# EasyEDA schematic LilyGo-LoRa32.json
TITLE: LilyGO LoRa Node with US Sensor; REV: 1.0; Date: 2024-10-19; Sheet: 1/1; Company: pkr
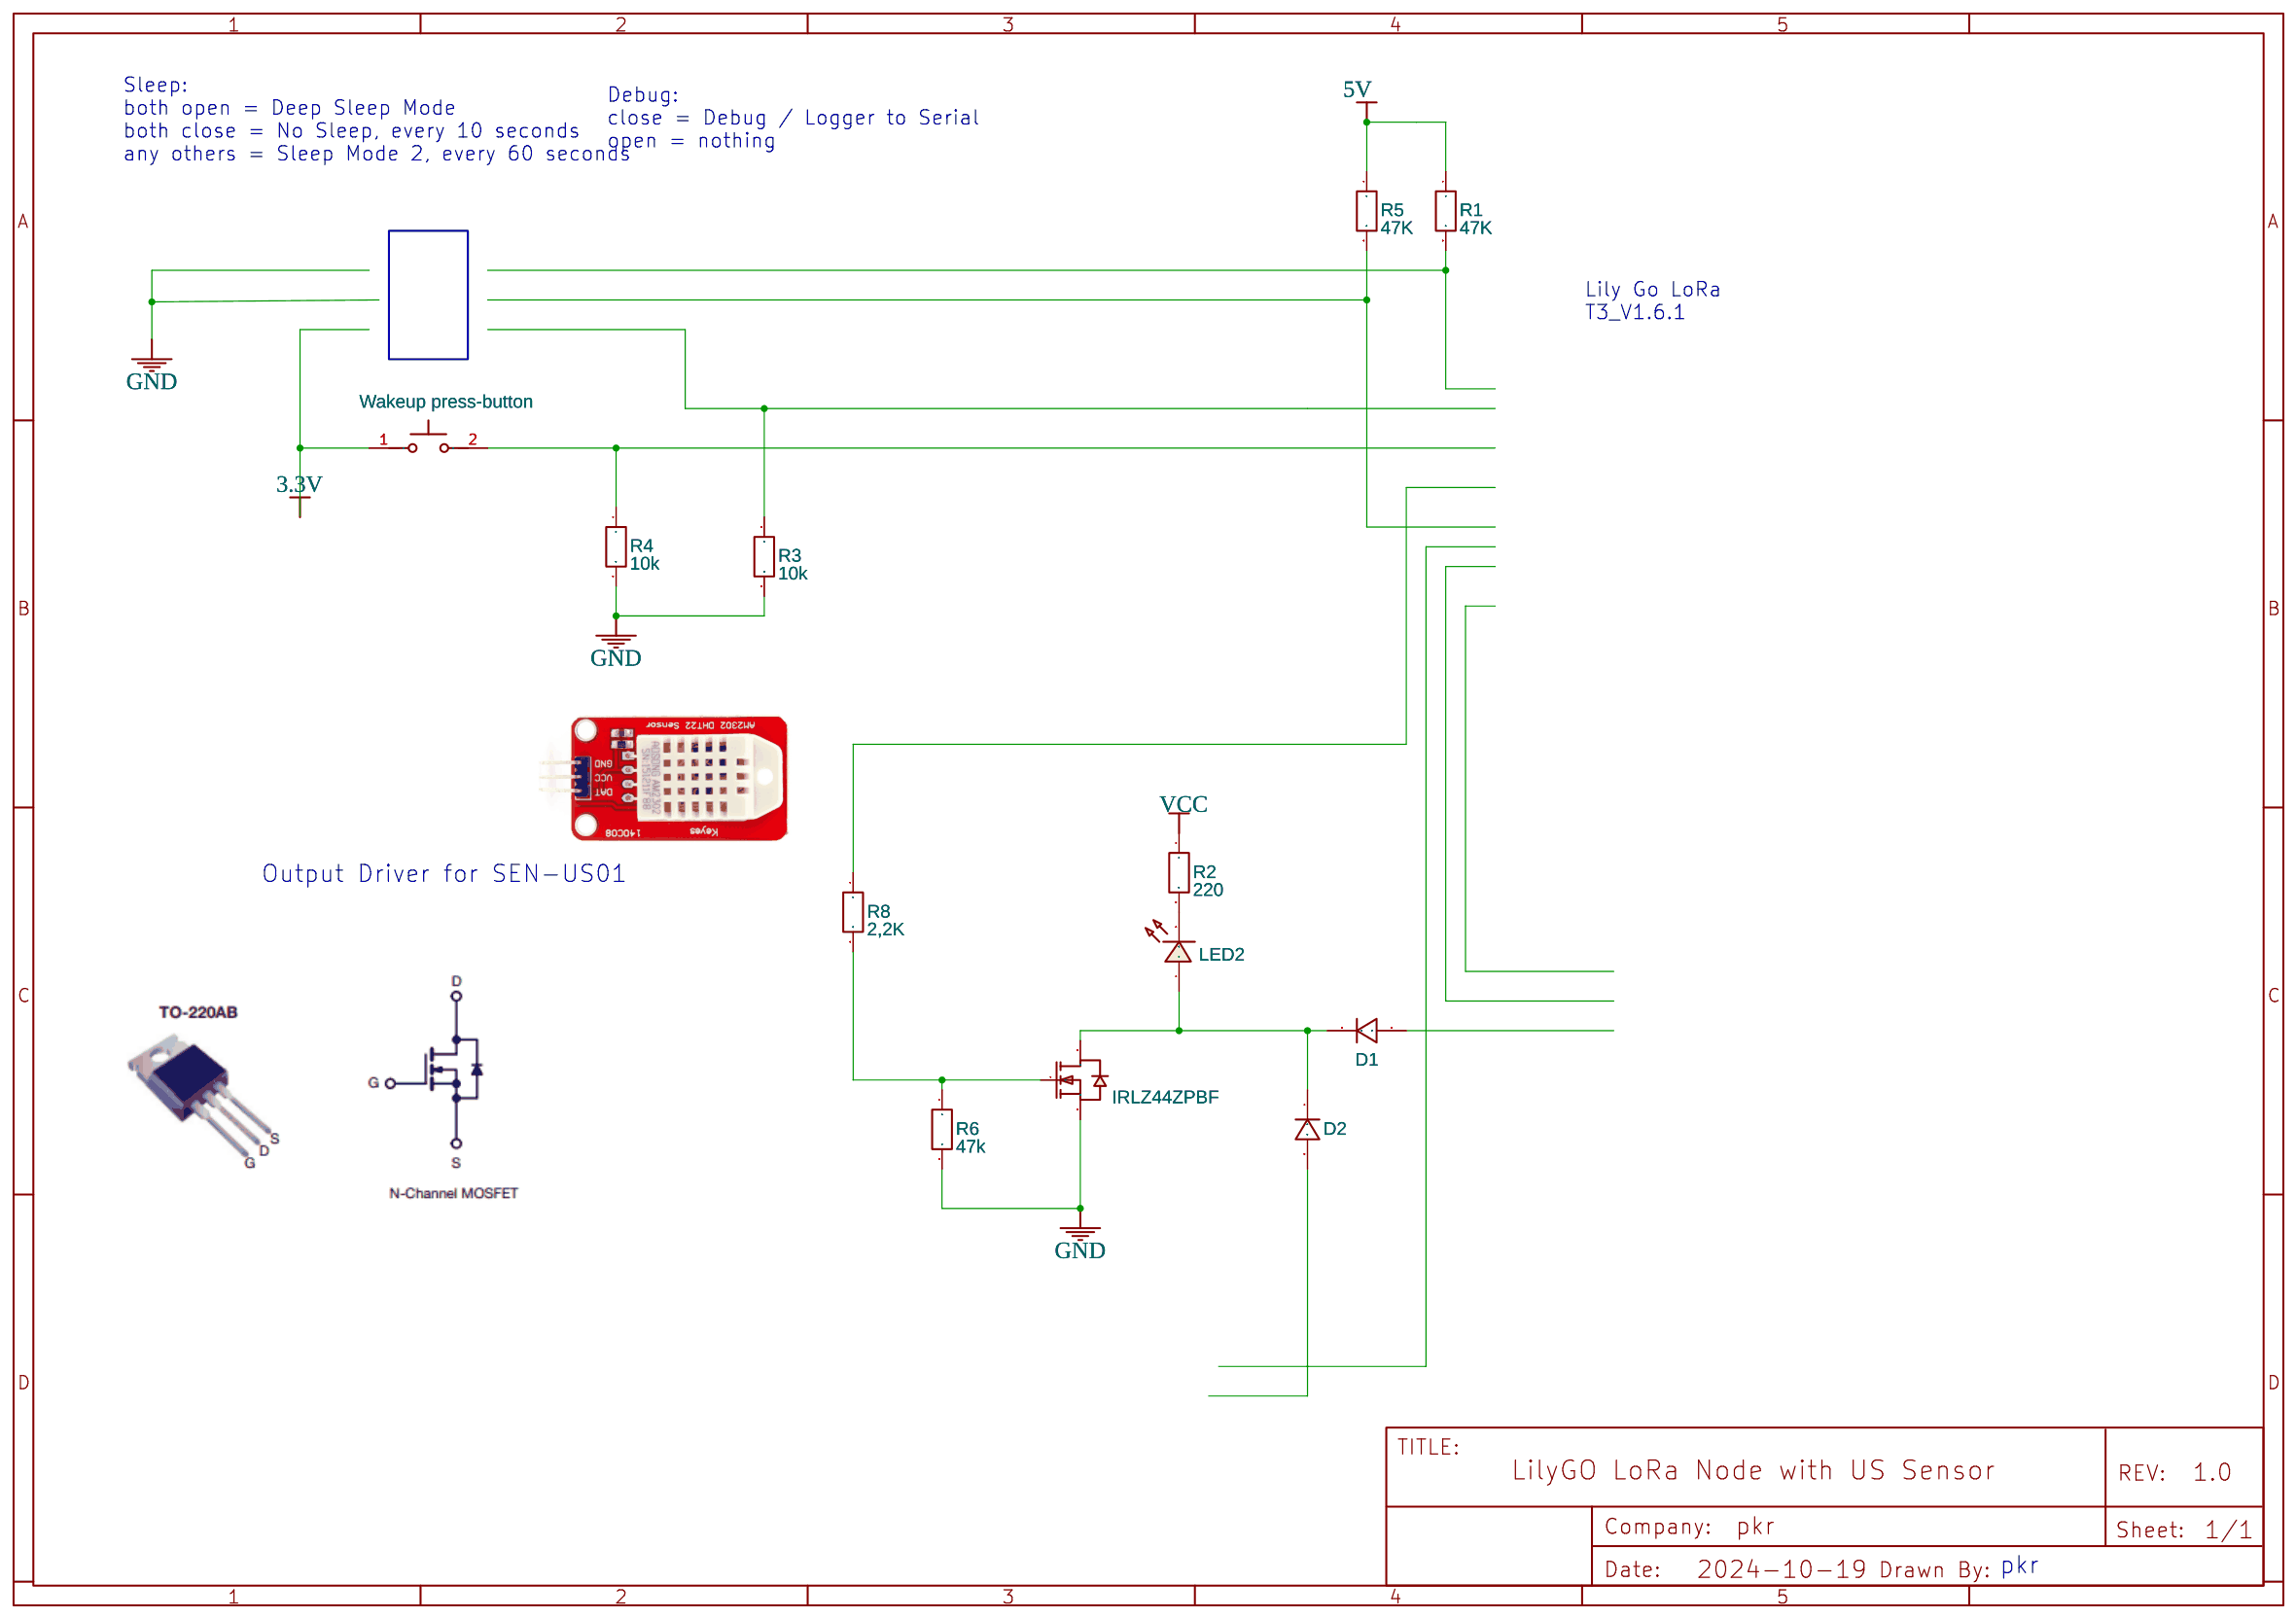
[diagram p0: schematic sheet]

## Parts
D1  1N4007W  [SOD-123_L2.8-W1.8-LS3.7-RD]
D2  1N4007W  [SOD-123_L2.8-W1.8-LS3.7-RD]
LED2  LED-0603_R  [LED0603_RED]
Q2  IRLZ44ZPBF  [TO-220-3_L10.0-W4.5-P2.54-L]
R1  47K  [R0603]
R2  220  [R0603]
R3  10k  [R0603]
R4  10k  [R0603]
R5  47K  [R0603]
R6  47k  [R0603]
R8  2,2K  [R0603]
SW1  Wakeup press-button  [KEY-TH_CPG1511F01S0X]

## Library data of the parts
D1 D2 = 1N4007W: Supplier: LCSC; Supplier Part: C328592; Manufacturer: BLUE ROCKET; Contributor: LCEDA_Lib
LED2 = LED-0603_R: Manufacturer: EVERLIGHT(台湾亿光); Manufacturer Part: 19-217/R6C-AL1M2VY/3T; Supplier Part: C72044; Supplier: LCSC; Contributor: LCEDA_01
Q2 = IRLZ44ZPBF: Contributor: LCSC; Supplier: LCSC; Supplier Part: C538200; Manufacturer: Infineon(英飞凌); JLCPCB Part Class: Extended Part
R1-R6 R8 = R_0603_EU: Contributor: LCEDA_Lib
SW1 = CPG1511F01S05: Contributor: LCSC; Supplier: LCSC; Supplier Part: C400225; Manufacturer: Kailh(凯华); JLCPCB Part Class: Extended Part

## Nets
3.3V: SW1.1
5V: R1.1 R5.1
GND: Q2.3(S) R3.2 R4.2 R6.2
VCC: R2.1
Net-(D1-1): D1.1 D2.1 LED2.1 Q2.2(D)
Net-(LED2-2): LED2.2 R2.2
Net-(Q2-1): Q2.1(G) R6.1 R8.2
Net-(R4-1): R4.1 SW1.2

Not connected (* = marked no-connect by the designer): D1 2; D2 2; R1 2; R3 1; R5 2; R8 1

## Notes on the sheet
- Sleep:
  both open = Deep Sleep Mode
  both close = No Sleep, every 10 seconds
  any others = Sleep Mode 2, every 60 seconds
- Debug:
  close = Debug / Logger to Serial
  open = nothing
- Lily Go LoRa
  T3_V1.6.1
- Output Driver for SEN-US01
- pkr
